# Altium schematic sheet RFID_PCB_Antenna_Main_circuit.SchDoc
size A4; PageSetup: Record=PageOptions|CenterHorizontal=True|CenterVertical=True|PrintScale=0.97|XCorrection=1.00|YCorrection=1.00|PrintKind=0|BorderSize=5000000|LeftOffset=0|BottomOffset=0|Orientation=2|PaperLength=1000|PaperWidth=1000|Scale=100|PaperSource=15|PrintQuality=-3|MediaType=1|DitherType=10|PrintScaleMode=1|PaperKind=A4|PaperIndex=9
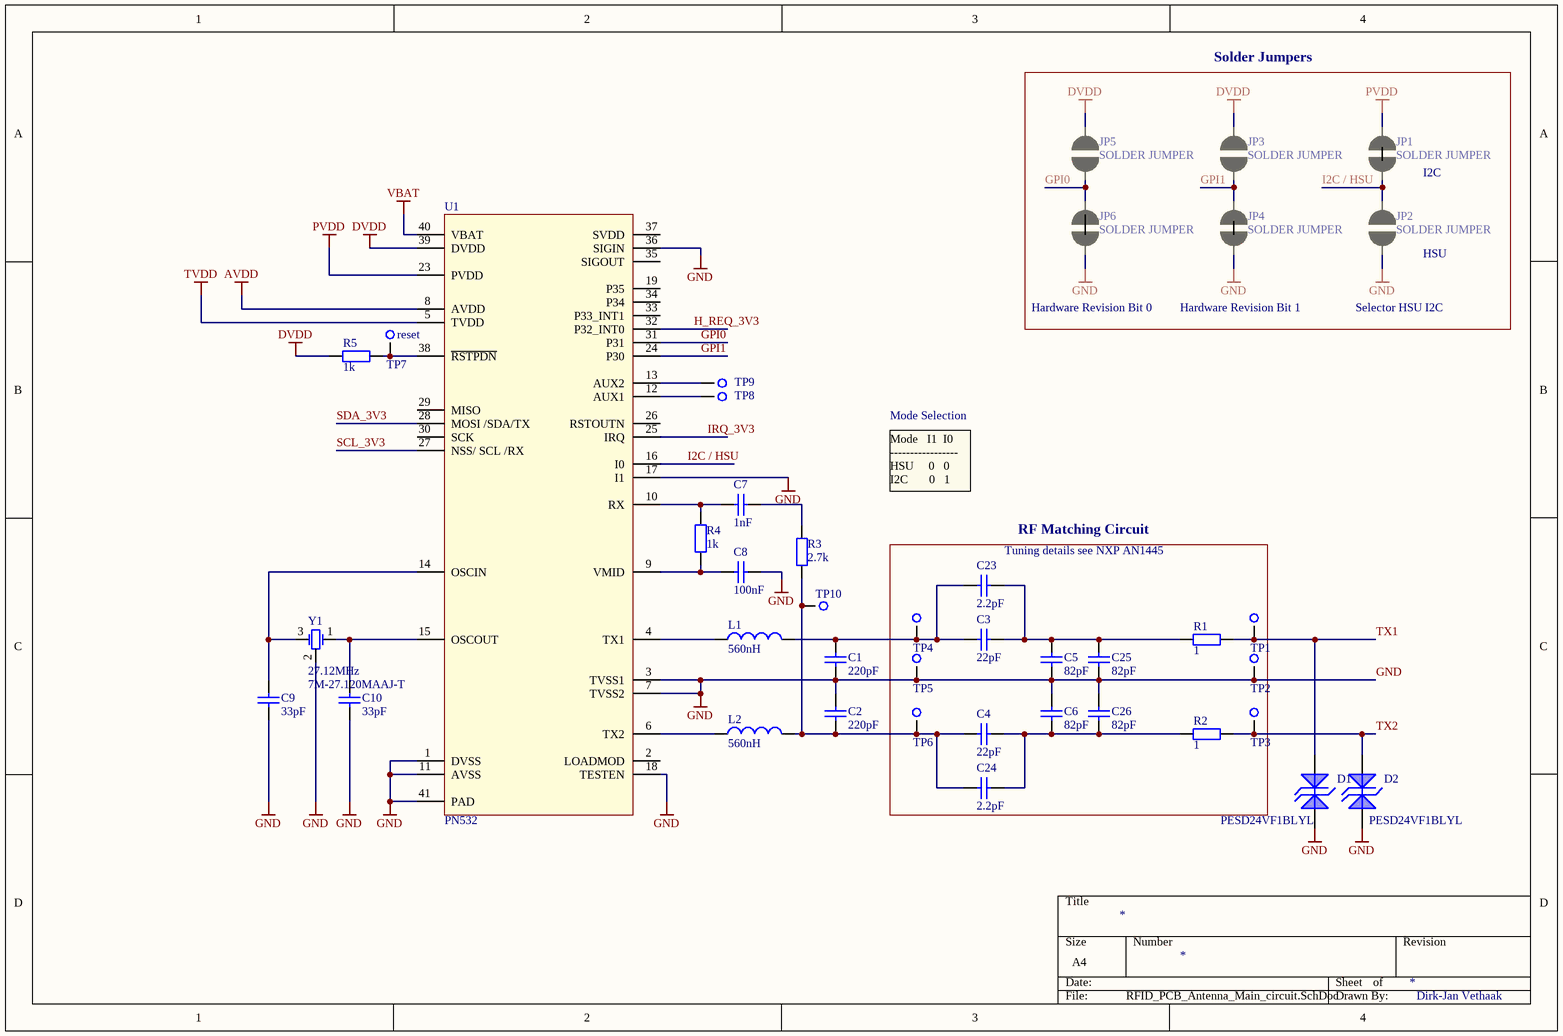
[diagram p0: RFID_PCB_Antenna_Main_circuit.SchDoc]

## Parts
C1  220pF  [cap0402]
C2  220pF  [cap0402]
C3  22pF  [cap0402]
C4  22pF  [cap0402]
C5  82pF  [cap0402]
C6  82pF  [cap0402]
C7  1nF  [cap0402]
C8  100nF  [cap0402]
C9  33pF  [cap0402]
C10  33pF  [cap0402]
C23  2.2pF  [cap0402]
C24  2.2pF  [cap0402]
C25  82pF  [cap0402]
C26  82pF  [cap0402]
D1  Manufacturer Part Number: PESD24VF1BLYL  [DFN65P100X50-2N]  (hidden comment: PESD24VF1BL)
D2  Manufacturer Part Number: PESD24VF1BLYL  [DFN65P100X50-2N]  (hidden comment: PESD24VF1BL)
JP1  SOLDER JUMPER  [Jumper Solder 0402]
JP2  SOLDER JUMPER  [Jumper Solder 0402]
JP3  SOLDER JUMPER  [Jumper Solder 0402]
JP4  SOLDER JUMPER  [Jumper Solder 0402]
JP5  SOLDER JUMPER  [Jumper Solder 0402]
JP6  SOLDER JUMPER  [Jumper Solder 0402]
L1  560nH  [C0603]
L2  560nH  [C0603]
R1  1  [RESC1105X04N]
R2  1  [RESC1105X04N]
R3  2.7k  [RESC1105X04N]
R4  1k  [RESC1105X04N]
R5  1k  [RESC1105X04N]
TP1  Testpoint  [Testpoint]  (value not drawn)
TP2  Testpoint  [Testpoint]  (value not drawn)
TP3  Testpoint  [Testpoint]  (value not drawn)
TP4  Testpoint  [Testpoint]  (value not drawn)
TP5  Testpoint  [Testpoint]  (value not drawn)
TP6  Testpoint  [Testpoint]  (value not drawn)
TP7  Testpoint  [TESTPOINT]  (value not drawn)
TP8  Testpoint  [Testpoint]  (value not drawn)
TP9  Testpoint  [Testpoint]  (value not drawn)
TP10  Testpoint  [Testpoint]  (value not drawn)
U1  PN532  [QFN50P600X600X100_HS-41N]
Y1  27.12MHz  [DFN170P250X71-4N]

## Blocks framed on the sheet
Solder Jumpers: JP1-JP6
RF Matching Circuit: C3-C6 C23-C26 R1 R2 TP1-TP6

## Nets
AVDD: U1.8(AVDD)
DVDD: JP3.2 JP5.2 R5.2 U1.39(DVDD)
GND: C1.1 C2.2 C5.1 C6.2 C8.1 C9.1 C10.1 C25.1 C26.2 D1.1(K1) D2.1(K1) JP2.1 JP4.1 JP6.1 TP2.1 TP5.1 U1.1(DVSS) U1.3(TVSS1) U1.7(TVSS2) U1.11(AVSS) U1.17(I1) U1.18(TESTEN) U1.36(SIGIN) U1.41(PAD) Y1.2
PVDD: JP1.2 U1.23(PVDD)
TVDD: U1.5(TVDD)
VBAT: U1.40(VBAT)
GPI0: JP5.1 JP6.2 U1.31(P31)
GPI1: JP3.1 JP4.2 U1.24(P30)
H_REQ_3V3: U1.32(P32_INT0)
I2C / HSU: JP1.1 JP2.2 U1.16(I0)
IRQ_3V3: U1.25(IRQ)
SCL_3V3: U1.27(NSS/_SCL_/RX)
SDA_3V3: U1.28(MOSI_/SDA/TX)
TX1: D1.2(K2) R1.2 TP1.1
TX2: D2.2(K2) R2.2 TP3.1
NetC1_2: C1.2 C3.1 C23.1 L1.2 TP4.1
NetC2_1: C2.1 C4.1 C24.1 L2.2 R3.1 TP6.1 TP10.1
NetC3_2: C3.2 C5.2 C23.2 C25.2 R1.1
NetC4_2: C4.2 C6.1 C24.2 C26.1 R2.1
NetC7_1: C7.1 R4.2 U1.10(RX)
NetC7_2: C7.2 R3.2
NetC8_2: C8.2 R4.1 U1.9(VMID)
NetC9_2: C9.2 U1.14(OSCIN) Y1.3
NetC10_2: C10.2 U1.15(OSCOUT) Y1.1
NetL1_1: L1.1 U1.4(TX1)
NetL2_1: L2.1 U1.6(TX2)
NetR5_1: R5.1 TP7.1 U1.38(~{RSTPDN})
NetTP8_1: TP8.1 U1.12(AUX1)
NetTP9_1: TP9.1 U1.13(AUX2)

Not connected (* = marked no-connect by the designer): U1 2(LOADMOD) 19(P35) 20(NC) 21(NC) 22(NC) 26(RSTOUTN) 29(MISO) 30(SCK) 33(P33_INT1) 34(P34) 35(SIGOUT) 37(SVDD)

## Notes on the sheet
- I2C
- Hardware Revision Bit 0
- Hardware Revision Bit 1
- Selector HSU I2C
- (near JP2) HSU
- (near TP7) reset
- Mode Selection
- Mode   I1  I0
  -----------------
  HSU     0   0
  I2C       0   1
- (near C23) Tuning details see NXP AN1445
- Dirk-Jan Vethaak

## Library data of the parts
C1 C2 = C0402: Manufacturer: Murata Electronics North America; Manufacturer Part Number: GRM1555C1H221JA01D; Tolerance: ±5%; Voltage - Rated: 50V; Temperature Coefficient: C0G, NP0; Supplier 1: Digi-Key; Supplier Part Number 1: 490-1293-2-ND; RoHS: RoHS Compliant; Category: Capacitors; Stock 1: 650000; Pricing 1: 10000=0.00442, 20000=0.00421, 30000=0.004, 50000=0.00358, 100000=0.00289 (EUR); Packaging: Tape & Reel (TR); Capacitance: 220pF; Mounting Type: Surface Mount, MLCC; Operating Temperature: -55°C ~ 125°C; Applications: General Purpose; Ratings: -; Package / Case: 0402 (1005 Metric); Size / Dimension: 0.039" L x 0.020" W (1.00mm x 0.50mm); Height - Seated (Max): -; Thickness (Max): 0.022" (0.55mm); Lead Spacing: -; Features: -; Lead Style: -; ComponentLink1URL: http://www.murata.com/~/media/webrenewal/support/library/catalog/products/capacitor/mlcc/c02e.pdf; ComponentLink1Description: http://www.murata.com/~/media/webrenewal/support/library/catalog/products/capacitor/mlcc/c02e.pdf
C3 C4 = C0402: Manufacturer: Murata Electronics North America; Manufacturer Part Number: GRM1555C1H220FA01D; Tolerance: ±1%; Voltage - Rated: 50V; Temperature Coefficient: C0G, NP0; Supplier 1: Digi-Key; Supplier Part Number 1: 490-8589-2-ND; RoHS: RoHS Compliant; Category: Capacitors; Stock 1: 150000; Pricing 1: 10000=0.00677, 20000=0.00645, 30000=0.00613, 50000=0.00548, 100000=0.00443 (EUR); Packaging: Tape & Reel (TR); Capacitance: 22pF; Mounting Type: Surface Mount, MLCC; Operating Temperature: -55°C ~ 125°C; Applications: General Purpose; Ratings: -; Package / Case: 0402 (1005 Metric); Size / Dimension: 0.039" L x 0.020" W (1.00mm x 0.50mm); Height - Seated (Max): -; Thickness (Max): 0.022" (0.55mm); Lead Spacing: -; Features: -; Lead Style: -; ComponentLink1URL: http://www.murata.com/~/media/webrenewal/support/library/catalog/products/capacitor/mlcc/c02e.pdf; ComponentLink1Description: http://www.murata.com/~/media/webrenewal/support/library/catalog/products/capacitor/mlcc/c02e.pdf
C5 C6 C25 C26 = C0402: Manufacturer: AVX; Manufacturer Part Number: 04025A820FAT2A; Capacitance: 82; Capacitance Tolerance: ± 1%; Dielectric Characteristic: C0G / NP0; Voltage Rating: 50; Ceramic Capacitor Case: 0402 [1005 Metric]; SVHC: No SVHC (17-Dec-2015); Capacitor Terminals: SMD; External Depth: 0.5; External Length / Height: 0.25; External Width: 1; No. of Pins: 2; Temperature Coefficient: 0ppm/°C ± 30ppm/°C<!--FANDB--><div class="features-and-benefits-container"><div class="features-and-benefits-description"><span class="features-benefits-value">The AVX multilayer ceramic capacitors with EIA class I, C0G (NP0) dielectric material are highly stable ceramic chip capacitors for general purpose applications. This multilayer ceramic capacitor is a monolithic block of ceramic containing two sets of offset, interleaved planar electrodes that extend to two opposite surfaces of ceramic dielectric.</span></div><div class="features-and-benefits-list"><ul class="features-and-benefits-list-list"><li class="features-and-benefits-list-item">Capacitance value ranges from 0.5pF to 0.1?F</li><li class="features-and-benefits-list-item">EIA 0101, 0201, 0402, 0603, 0805, 1206, 1210, 1812, 1825, 2220, 2225 case sizes available</li><li class="features-and-benefits-list-item">Rated DC voltage of 6.3V, 10V, 16V, 25V, 50V, 100V, 200V, 500V</li><li class="features-and-benefits-list-item">±0.10pF, ±0.25pF, ±0.50pF, ±1%, ±2%, ±5% and ±10% tolerance</li><li class="features-and-benefits-list-item">Nickel (Ni) and tin (Sn) plated terminations</li><li class="features-and-benefits-list-item">Load life of 1000h at 125?C</li><li class="features-and-benefits-list-item">Operating temperature range -55?C to 125; Supplier 1: Farnell; Supplier Part Number 1: 1740575; RoHS: YES; Stock 1: 22436; Pricing 1: 10=0.379, 100=0.076, 500=0.038, 2500=0.0228, 5000=0.019, 10000=0.0163, 50000=0.0143, 100000=0.0127 (GBP); Product Range: -; Operating Temperature Min: -55; Operating Temperature Max: 125; Packaging: Cut Tape; MSL: MSL 1 - Unlimited; Capacitance Tolerance ±: ± 1%; Operating Temperature Range: -55°C to +125; ComponentLink1URL: http://www.farnell.com/datasheets/425357.pdf; ComponentLink1Description: http://www.farnell.com/datasheets/425357.pdf
C7 = C0402: Manufacturer: Vishay / Vitramon; Manufacturer Part Number: VJ0402Y102KXAAC; Capacitance: 1000 pF; Tolerance: 10 %; Type: Commercial SMD MLCCs; Voltage Rating DC: 50 VDC; Dielectric: X7R; Qualification: Commercial; Supplier 1: Mouser; Supplier Part Number 1: 77-VJ0402Y102KXAAC; RoHS: RoHS Compliant; Category: Multilayer Ceramic Capacitors MLCC - SMD/SMT; Stock 1: 19151; Pricing 1: 1=0.060, 50=0.050, 100=0.044, 500=0.043, 5000=0.043 (USD); Height: 0.6 mm; Length: 1 mm; Package / Case: 0402 (1005 metric); Packaging: Reel; Product: General Type MLCCs; Series: VJ COMM; Termination Style: SMD/SMT; Voltage Rating AC: -; Width: 0.5 mm; Brand: Vishay / Vitramon; Case Code - in: 0402; Case Code - mm: 1005; Maximum Operating Temperature: + 125 C; Minimum Operating Temperature: - 55 C; Product Category: Ceramic Chip Capacitors; RoHS - Mouser: Y; Minimum Order Quantity: 1; Reeling: True; ComponentLink1URL: http://www.mouser.com/ds/2/427/vjcommercialseries-222796.pdf; ComponentLink1Description: http://www.mouser.com/ds/2/427/vjcommercialseries-222796.pdf
C8 = C0402: Manufacturer: Vishay / Vitramon; Manufacturer Part Number: VJ0402G104KXQCW1BC; Capacitance: 0.1 uF; Tolerance: 10 %; Type: Ultra Small Commodity MLCCs; Voltage Rating DC: 10 VDC; Dielectric: X5R; Qualification: Commercial; Supplier 1: Mouser; Supplier Part Number 1: 77-VJ0402G104KXQCBC; RoHS: RoHS Compliant; Category: Multilayer Ceramic Capacitors MLCC - SMD/SMT; Stock 1: 26687; Pricing 1: 1=0.100, 50=0.080, 100=0.066, 500=0.047, 1000=0.028, 10000=0.021, 20000=0.019, 50000=0.012, 100000=0.010 (USD); Height: 0.55 mm; Length: 1 mm; Package / Case: 0402 (1005 metric); Packaging: Reel; Product: General Type MLCCs; Series: VJ W1BC; Termination Style: SMD/SMT; Voltage Rating AC: -; Width: 0.5 mm; Brand: Vishay / Vitramon; Case Code - in: 0402; Case Code - mm: 1005; Maximum Operating Temperature: + 85 C; Minimum Operating Temperature: - 55 C; Product Category: Ceramic Chip Capacitors; RoHS - Mouser: Y; Minimum Order Quantity: 1; Reeling: True; ComponentLink1URL: http://www.mouser.com/ds/2/427/vjw1bcbascomseries-223529.pdf; ComponentLink1Description: http://www.mouser.com/ds/2/427/vjw1bcbascomseries-223529.pdf
C9 C10 = C0402: Manufacturer: MURATA; Manufacturer Part Number: GRM1555C1H330JA01D; Product Range: GRM Series; Capacitance: 33; Capacitance Tolerance: ± 5%; Dielectric Characteristic: C0G / NP0; Voltage Rating: 50; Ceramic Capacitor Case: 0402 [1005 Metric]; SVHC: No SVHC (17-Dec-2015; Supplier 1: Farnell; Supplier Part Number 1: 2434643; RoHS: YES; Stock 1: 32150; Pricing 1: 10=0.0078, 100=0.0064, 500=0.005, 2500=0.0033, 5000=0.0032, 10000=0.0026, 50000=0.002, 100000=0.0019 (GBP); Operating Temperature Min: -55; Operating Temperature Max: 125; Packaging: Cut Tape; MSL: MSL 1 - Unlimited; ComponentLink1URL: http://www.farnell.com/datasheets/2047983.pdf; ComponentLink1Description: http://www.farnell.com/datasheets/2047983.pdf
C23 C24 = C0402: Manufacturer: MURATA; Manufacturer Part Number: GRM1555C1H2R2CA01D; Product Range: GRM Series; Capacitance: 2.2; Capacitance Tolerance: ± 0.25; Dielectric Characteristic: C0G / NP0; Voltage Rating: 50; Ceramic Capacitor Case: 0402 [1005 Metric]; SVHC: No SVHC (17-Dec-2015)<!--FANDB--><div class="features-and-benefits-container"><div class="features-and-benefits-description"><span class="features-benefits-value">The GRM1555C1H2R2CA01D is a Multilayer Ceramic Capacitor for general purpose, C0G/NP0 dielectric and 0402 case. Since the external electrodes consist of a plated structure, the product is excellent in soldering heat resistance. The profile dimensions have been standardized with high precision, therefore high reliability can be acquired in the case of automatic mounting.</span></div><div class="features-and-benefits-list"><ul class="features-and-benefits-list-list"><li class="features-and-benefits-list-item">High reliability with no polarity</li><li class="features-and-benefits-list-item">Low impedance in high frequencies and excellent in pulse response and noise elimination</li></ul></div><div class="features-and-benefits-applications"><ul class="features-and-benefits-value"><li class="features-and-benefits-list-item">Industrial</li></ul></div></div>; Supplier 1: Farnell; Supplier Part Number 1: 2434609; RoHS: YES; Stock 1: 133410; Pricing 1: 10=0.0091, 100=0.0057, 500=0.005, 2500=0.0033, 5000=0.0032, 10000=0.0024, 50000=0.002, 100000=0.0018 (GBP); Operating Temperature Min: -55; Operating Temperature Max: 125; Packaging: Cut Tape; MSL: MSL 1 - Unlimited; ComponentLink1URL: http://www.farnell.com/datasheets/2047874.pdf; ComponentLink1Description: http://www.farnell.com/datasheets/2047874.pdf
D1 D2 = Biploar TVS Diode: TVS DIODE 24VWM 17VC DFN1006-2; Manufacturer: NXP Semiconductors; Type: Zener; Bidirectional Channels: 1; Voltage - Reverse Standoff (Typ): 24V (Max); Voltage - Breakdown (Min): 24.5V; Voltage - Clamping (Max) @ Ipp: 17V; Current - Peak Pulse (10/1000µs): 1A (8/20µs); Power Line Protection: No; Capacitance @ Frequency: 0.3pF @ 1MHz; Supplier 1: Digi-Key; RoHS: RoHS Compliant; Category: Circuit Protection; Stock 1: 30000; Pricing 1: 10000=0.09736, 30000=0.0893, 50000=0.08595, 100000=0.08393, 250000=0.08259 (EUR); Packaging: Tape & Reel (TR); Unidirectional Channels: -; Power - Peak Pulse: -; Applications: Automotive; Operating Temperature: -55°C ~ 150°C (TA); Mounting Type: Surface Mount; Package / Case: SOD-882; Supplier Device Package: SOD-882; ComponentLink1URL: http://www.nxp.com/documents/data_sheet/PESD24VF1BL.pdf; ComponentLink1Description: http://www.nxp.com/documents/data_sheet/PESD24VF1BL.pdf; Supplier Part Number 1: 568-12543-2-ND
JP1-JP6 = JUMPER 2 SOLDER: Manufacturer: VISHAY; Manufacturer Part Number: CRCW04020000Z0ED; ID: Library_CON-0010; Product Range: AEC-Q200 CRCW Series; Resistance: 0; Power Rating: 63; Voltage Rating: 50; Resistor Case Style: 0402 [1005 Metric]; Resistor Element Material: Thick Film; Temperature Coefficient: ± 100; Resistor Mounting: Surface Mount Device<!--FANDB--><div class="features-and-benefits-container"><div class="features-and-benefits-description"><span class="features-benefits-value">The Vishay D/CRCW e3 series are standard thick film chip resistors. The resistance range includes E96 and E24 decade values from 1ohm to 10Mohm. CRCW e3 series resistors have a pure tin solder contacts on the Ni barrier layer that provides compatibility with reflow soldering process.</span></div><div class="features-and-benefits-list"><ul class="features-and-benefits-list-list"><li class="features-and-benefits-list-item">Automotive grade AEC-Q200 qualified</li><li class="features-and-benefits-list-item">EIA 0402, 0603, 0805, 1206, 1210, 1218, 2010, 2512 standard case sizes available</li><li class="features-and-benefits-list-item">Stability &Delta; Mfg: -; Mfg code: -; Value: SOLDER JUMPER; Supplier 1: Farnell; RoHS: Y-EX; Stock 1: 111126; Pricing 1: 10=0.0194, 300=0.0152, 1000=0.0099, 2500=0.0078, 5000=0.0052 (GBP); Resistance Tolerance: -; Packaging: Cut Tape; MSL: MSL 1 - Unlimited; ComponentLink1URL: http://www.farnell.com/datasheets/2045673.pdf; ComponentLink1Description: http://www.farnell.com/datasheets/2045673.pdf; ComponentLink2URL: http://www.farnell.com/cad/1551206.zip; ComponentLink2Description: http://www.farnell.com/cad/1551206.zip
L1 L2 = Inductor: Murata LQW18CNR56J00D 560nH 5%; Manufacturer: Murata Electronics North America; Type: Wirewound; Material - Core: Ferrite; Current Rating: 450mA; Shielding: Unshielded; DC Resistance (DCR): 480 mOhm Max; Frequency - Self Resonant: 540MHz; Frequency - Test: 10MHz; Supplier 1: Digi-Key; Supplier Part Number 1: 490-10774-1-ND; Manufacturer Part Number: LQW18CNR56J00D; RoHS: RoHS Compliant; Category: Inductors, Coils, Chokes; Stock 1: 10277; Pricing 1: 1=0.47, 10=0.415, 25=0.39, 50=0.3376, 100=0.3117, 250=0.29612, 500=0.27014, 750=0.23897, 1000=0.22858 (EUR); Packaging: Cut Tape (CT); Inductance: 560nH; Tolerance: ±5%; Current - Saturation: -; Q @ Freq: -; Ratings: -; Operating Temperature: -40°C ~ 85°C; Mounting Type: Surface Mount; Package / Case: 0603 (1608 Metric); Size / Dimension: 0.063" L x 0.031" W (1.60mm x 0.80mm); Height - Seated (Max): 0.037" (0.95mm); ComponentLink1URL: http://www.murata.com/~/media/webrenewal/support/library/catalog/products/inductor/chip/o05e.ashx; ComponentLink1Description: http://www.murata.com/~/media/webrenewal/support/library/catalog/products/inductor/chip/o05e.ashx
R1 R2 = R0402: Manufacturer: MULTICOMP; Manufacturer Part Number: MCMR04W1R00FTL; Product Range: MCMR Series; Voltage Rating: 50; Resistor Case Style: 0402 [1005 Metric]; Power Rating: 62.5; Resistance Tolerance: ± 1%; Resistor Element Material: Ceramic; Temperature Coefficient: -200ppm/°C to +400; SVHC: No SVHC (17-Dec-2015); Resistor Mounting: Surface Mount Device<!--FANDB--><div class="features-and-benefits-container"><div class="features-and-benefits-description"><span class="features-benefits-value">The Multicomp MCMR series resistors are automotive grade, anti sulphured thick film chip resistor. The resistance range includes E24 and E96 decade values from 1ohm to 10Mohm. These resistors are constructed on top of a high grade ceramic body.</span></div><div class="features-and-benefits-list"><ul class="features-and-benefits-list-list"><li class="features-and-benefits-list-item">EIA 0402, 0603, 0805, 1206 chip sizes available</li><li class="features-and-benefits-list-item">High reliability and stability</li><li class="features-and-benefits-list-item">Automotive grade AEC-Q200 compliant</li><li class="features-and-benefits-list-item">Complaint with (IEC 60068-1) 55/155/56 climatic category</li><li class="features-and-benefits-list-item">Maximum operation voltage of 50V, 75V, 150V and 200V</li><li class="features-and-benefits-list-item">Power rating of 62.5mW, 100mW, 125mW and 250mW</li><li class="features-and-benefits-list-item">Available in ±1% and ±5% tolerance</li><li class="features-and-benefits-list-item">Temperature coefficient (TCR) of +200ppm/°C, +100ppm/°C and -200ppm/°C to +400ppm/°C</li><li class="features-and-benefits-list-item">Operating temperature range -55°C to 155; Supplier 1: Farnell; Supplier Part Number 1: 2072500; RoHS: YES; Stock 1: 17702; Pricing 1: 10=0.0192, 100=0.0151, 500=0.0109, 2500=0.0047, 5000=0.004, 10000=0.0033, 50000=0.0023, 100000=0.002 (GBP); Resistance: 1; Packaging: Cut Tape; MSL: -; ComponentLink1URL: http://www.farnell.com/datasheets/1716705.pdf; ComponentLink1Description: http://www.farnell.com/datasheets/1716705.pdf
R3 = R0402: Manufacturer: Vishay Dale; Manufacturer Part Number: CRCW04022K70FKED; Tolerance: ±1%; Power (Watts): 0.063W, 1/16W; Temperature Coefficient: ±100ppm/°C; Supplier 1: Digi-Key; Supplier Part Number 1: 541-2.70KLTR-ND; RoHS: RoHS Compliant; Category: Resistors; Stock 1: 70000; Pricing 1: 10000=0.00292, 30000=0.00256, 50000=0.00235, 100000=0.0023 (EUR); Packaging: Tape & Reel (TR); Resistance (Ohms): 2.7k; Composition: Thick Film; Features: Automotive AEC-Q200; Operating Temperature: -55°C ~ 155°C; Package / Case: 0402 (1005 Metric); Supplier Device Package: 0402 (1005 Metric); Size / Dimension: 0.039" L x 0.020" W (1.00mm x 0.50mm); Height: 0.016" (0.40mm); Number of Terminations: 2; ComponentLink1URL: http://www.vishay.com/docs/20035/dcrcwe3.pdf; ComponentLink1Description: http://www.vishay.com/docs/20035/dcrcwe3.pdf
R4 R5 = R0402: Manufacturer: Vishay Beyschlag; Manufacturer Part Number: MCS04020C1001FE000; Tolerance: ±1%; Power (Watts): 0.1W, 1/10W; Temperature Coefficient: ±50ppm/°C; Supplier 1: Digi-Key; Supplier Part Number 1: MCS0402-1.00K-CFTR-ND; RoHS: RoHS Compliant; Category: Resistors; Stock 1: 80000; Pricing 1: 10000=0.02474, 30000=0.0235, 50000=0.02302, 100000=0.02253 (EUR); Packaging: Tape & Reel (TR); Resistance (Ohms): 1k; Composition: Thin Film; Features: -; Operating Temperature: -55°C ~ 155°C; Package / Case: 0402 (1005 Metric); Supplier Device Package: 0402; Size / Dimension: 0.039" L x 0.020" W (1.00mm x 0.50mm); Height: 0.015" (0.37mm); Number of Terminations: 2; ComponentLink1URL: http://www.vishay.com/docs/28705/mcx0x0xpro.pdf; ComponentLink1Description: http://www.vishay.com/docs/28705/mcx0x0xpro.pdf
TP1-TP6 TP8-TP10 = Testpoint: ID: Library_MISC-0001; Faber ItemCode: -; Mfg: -; Mfg code: -; Info: Testpoint; Value: Testpoint
TP7 = Testpoint 1mm: ID: Library_MISC-0001; Faber ItemCode: -; Mfg: -; Mfg code: -; Info: Testpoint; Value: Testpoint
U1 = PN532: PN5321A3HN; Manufacturer: NXP; Manufacturer Part Number: PN5321A3HN/C106;55; Supplier 1: Farnell; RoHS: YES; Stock 1: 1123; Pricing 1: 1=8.6, 10=7.23, 100=5.37, 300=5.17, 700=5.08, 2000=4.34, 3000=4.27 (GBP); ComponentLink1URL: http://www.farnell.com/datasheets/1751691.pdf; ComponentLink1Description: http://www.farnell.com/datasheets/1751691.pdf; ComponentLink2URL: http://www.farnell.com/cad/1722221.zip; ComponentLink2Description: http://www.farnell.com/cad/1722221.zip; Supplier Part Number 1: 1902845
Y1 = XTAL-3: 7M-27.120MAAJ-T; Manufacturer: TXC CORPORATION; Frequency Stability: ±30ppm; Load Capacitance: 18pF; ESR (Equivalent Series Resistance): 60 Ohm; Operating Mode: Fundamental; Supplier 1: Digi-Key; RoHS: RoHS Compliant; Category: Crystals and Oscillators; Stock 1: 37105; Pricing 1: 1=0.85, 10=0.748, 50=0.6988, 100=0.6185, 500=0.58444, 1000=0.48858 (EUR); Packaging: Cut Tape (CT); Type: MHz Crystal; Frequency: 27.12MHz; Frequency Tolerance: ±30ppm; Operating Temperature: -20°C ~ 70°C; Ratings: -; Mounting Type: Surface Mount; Package / Case: 4-SMD, No Lead (DFN, LCC); Size / Dimension: 0.126" L x 0.098" W (3.20mm x 2.50mm); Height: 0.031" (0.80mm); ComponentLink1URL: http://www.txccrystal.com/images/pdf/7m.pdf; ComponentLink1Description: http://www.txccrystal.com/images/pdf/7m.pdf; Supplier Part Number 1: 887-1424-1-ND; Manufacturer Part Number: 7M-27.120MAAJ-T